# EAGLE design akabeacon_circle_MDBT40_type3 (EAGLE 9.6.2)
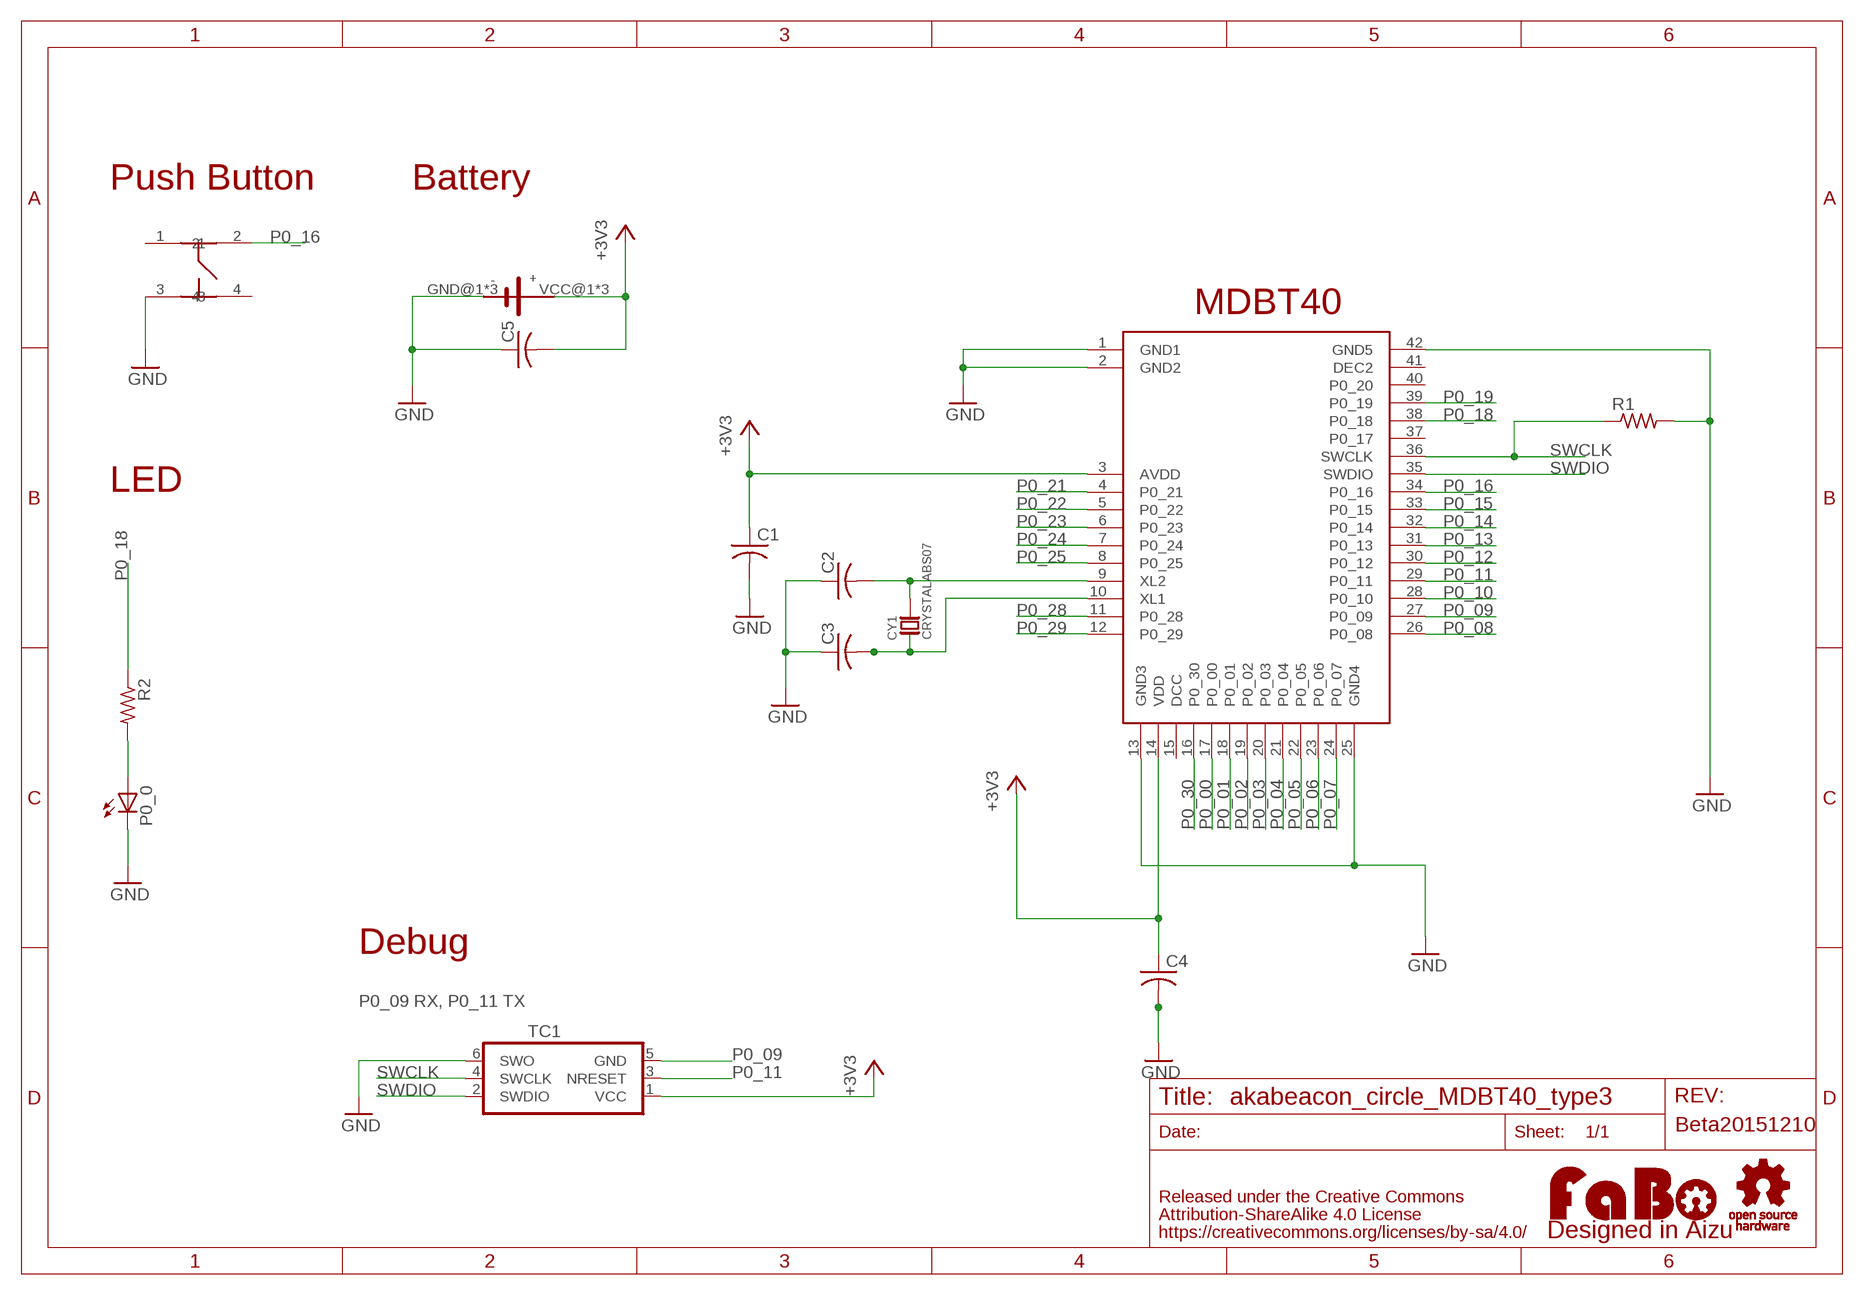
[diagram p0: schematic, sheet 1]

## Parts
C1  C-USC0603  [C0603]
C2  C-USC0603  [C0603]
C3  C-USC0603  [C0603]
C4  C-USC0603  [C0603]
C5  C-USC0603  [C0603]
CY1  CRYSTALABS07  [ABRACOM-ABS07-32.768KHZ]
P0_0  LEDCHIP-LED0603  [CHIP-LED0603]
R1  R-US_R0603  [R0603]
R2  R-US_R0603  [R0603]
TC1  TC2030-IDC-NL  [TC2030-IDC-NL]
U$1  RAYTAC-MDBT40  [RAYTAC-MDBT40]
U$2  LOGO_FABO-M  [LOGO_FABO_MS]
U$3  SQUARE-TYPE3  [SQUARE-TYPE3]
U$4  LOGO_OSHW-M_BOTTOM  [LOGO_OSHW_M_BOTTOM]
U$5  SWICTH-4P(KMR2)  [SWITCH-4P(KMR2)]

## Nets
+3V3: C1.1 C4.1 C5.2 TC1.1(VCC) U$1.3(AVDD) U$1.14(VDD) U$3.VCC@1(VCC) U$3.VCC@2(VCC) U$3.VCC@3(VCC)
GND: C1.2 C2.1 C3.1 C4.2 C5.1 P0_0.C R1.2 TC1.6(SWO) U$1.1(GND1) U$1.2(GND2) U$1.13(GND3) U$1.25(GND4) U$1.42(GND5) U$3.GND@1(GND) U$3.GND@2(GND) U$3.GND@3(GND) U$5.3
N$1: P0_0.A R2.2
N$7: C2.2 CY1.P$2 U$1.9(XL2)
N$8: C3.2 CY1.P$1 U$1.10(XL1)
P0_00: U$1.17(P0_00)
P0_01: U$1.18(P0_01)
P0_02: U$1.19(P0_02)
P0_03: U$1.20(P0_03)
P0_04: U$1.21(P0_04)
P0_05: U$1.22(P0_05)
P0_06: U$1.23(P0_06)
P0_07: U$1.24(P0_07)
P0_08: U$1.26(P0_08)
P0_09: TC1.5(GND) U$1.27(P0_09)
P0_10: U$1.28(P0_10)
P0_11: TC1.3(NRESET) U$1.29(P0_11)
P0_12: U$1.30(P0_12)
P0_13: U$1.31(P0_13)
P0_14: U$1.32(P0_14)
P0_15: U$1.33(P0_15)
P0_16: U$1.34(P0_16) U$5.2
P0_18: R2.1 U$1.38(P0_18)
P0_19: U$1.39(P0_19)
P0_21: U$1.4(P0_21)
P0_22: U$1.5(P0_22)
P0_23: U$1.6(P0_23)
P0_24: U$1.7(P0_24)
P0_25: U$1.8(P0_25)
P0_28: U$1.11(P0_28)
P0_29: U$1.12(P0_29)
P0_30: U$1.16(P0_30)
SWCLK: R1.1 TC1.4(SWCLK) U$1.36(SWCLK)
SWDIO: TC1.2(SWDIO) U$1.35(SWDIO)
Unconnected: U$1.15(DCC) U$1.37(P0_17) U$1.40(P0_20) U$1.41(DEC2) U$5.1 U$5.4

## Notes on the sheet
- Push Button | Battery
- MDBT40
- LED
- Debug
- P0_09 RX, P0_11 TX
- Beta20151210

## Library data of the parts
C1-C5 = adafruit:C-US: CAPACITOR, American symbol
CY1 = FaBo-Crystal:CRYSTAL
P0_0 = led:LED: LED OSRAM: - CHIPLED LG R971, LG N971, LY N971, LG Q971, LY Q971, LO R971, LY R971 LH N974, LH R974 LS Q976, LO Q976, LY Q976 LO Q996 - Hyper CHIPLED LW Q18S LB Q993, LB Q99A, LB R99A - SideLED LS A670, LO A670, LY A670, LG A670, LP A670 LB A673, LV A673, LT A673, LW A673 LH A674 LY A675 LS A676, LA A676, LO A676, LY A676, LW A676 LS A679, LY A679, LG A679 - Hyper Micro SIDELED® LS Y876, LA Y876, LO Y876, LY Y876 LT Y87S - SmartLED LW L88C, LW L88S LB L89C, LB L89S, LG L890 LS L89K, LO L89K, LY L89K LS L896, LA L896, LO L896, LY L896 - TOPLED LS T670, LO T670, LY T670, LG T670, LP T670 LSG T670, LSP T670, LSY T670, LOP T670, LYG T670 LG T671, LOG T671, LSG T671 LB T673, LV T673, LT T673, LW T673 LH T674 LS T676, LA T676, LO T676, LY T676, LB T676, LH T676, LSB T676, LW T676 LB T67C, LV T67C, LT T67C, LS T67K, LO T67K, LY T67K, LW E67C LS E67B, LA E67B, LO E67B, LY E67B, LB E67C, LV E67C, LT E67C LW T67C LS T679, LY T679, LG T679 LS T770, LO T770, LY T770, LG T770, LP T770 LB T773, LV T773, LT T773, LW T773 LH T774 LS E675, LA E675, LY E675, LS T675 LS T776, LA T776, LO T776, LY T776, LB T776 LHGB T686 LT T68C, LB T68C - Hyper Mini TOPLED® LB M676 - Mini TOPLED Santana® LG M470 LS M47K, LO M47K, LY M47K Source: http://www.osram.convergy.de LUXEON: - LUMILED® LXK2-PW12-R00, LXK2-PW12-S00, LXK2-PW14-U00, LXK2-PW14-V00 LXK2-PM12-R00, LXK2-PM12-S00, LXK2-PM14-U00 LXK2-PE12-Q00, LXK2-PE12-R00, LXK2-PE12-S00, LXK2-PE14-T00, LXK2-PE14-U00 LXK2-PB12-K00, LXK2-PB12-L00, LXK2-PB12-M00, LXK2-PB14-N00, LXK2-PB14-P00, LXK2-PB14-Q00 LXK2-PR12-L00, LXK2-PR12-M00, LXK2-PR14-Q00, LXK2-PR14-R00 LXK2-PD12-Q00, LXK2-PD12-R00, LXK2-PD12-S00 LXK2-PH12-R00, LXK2-PH12-S00 LXK2-PL12-P00, LXK2-PL12-Q00, LXK2-PL12-R00 Source: www.luxeon.com KINGBRIGHT: KA-3528ASYC Source: www.kingbright.com
R1 R2 = adafruit:R-US_: RESISTOR, American symbol
TC1 = TagConnect:TC2030-IDC: Tag-Connect In Circuit Programming & Debug Cable 6 Pin http://www.tag-connect.com
U$1 = FaBo-BT:RAYTAC-MDBT40
U$2 = FaBo-Logo:LOGO_FABO
U$3 = FaBo-Template:SQUARE-TYPE3
U$4 = FaBo-Logo:LOGO_OSHW
U$5 = gclue-test:SWICTH-4P(KMR2)

## Board
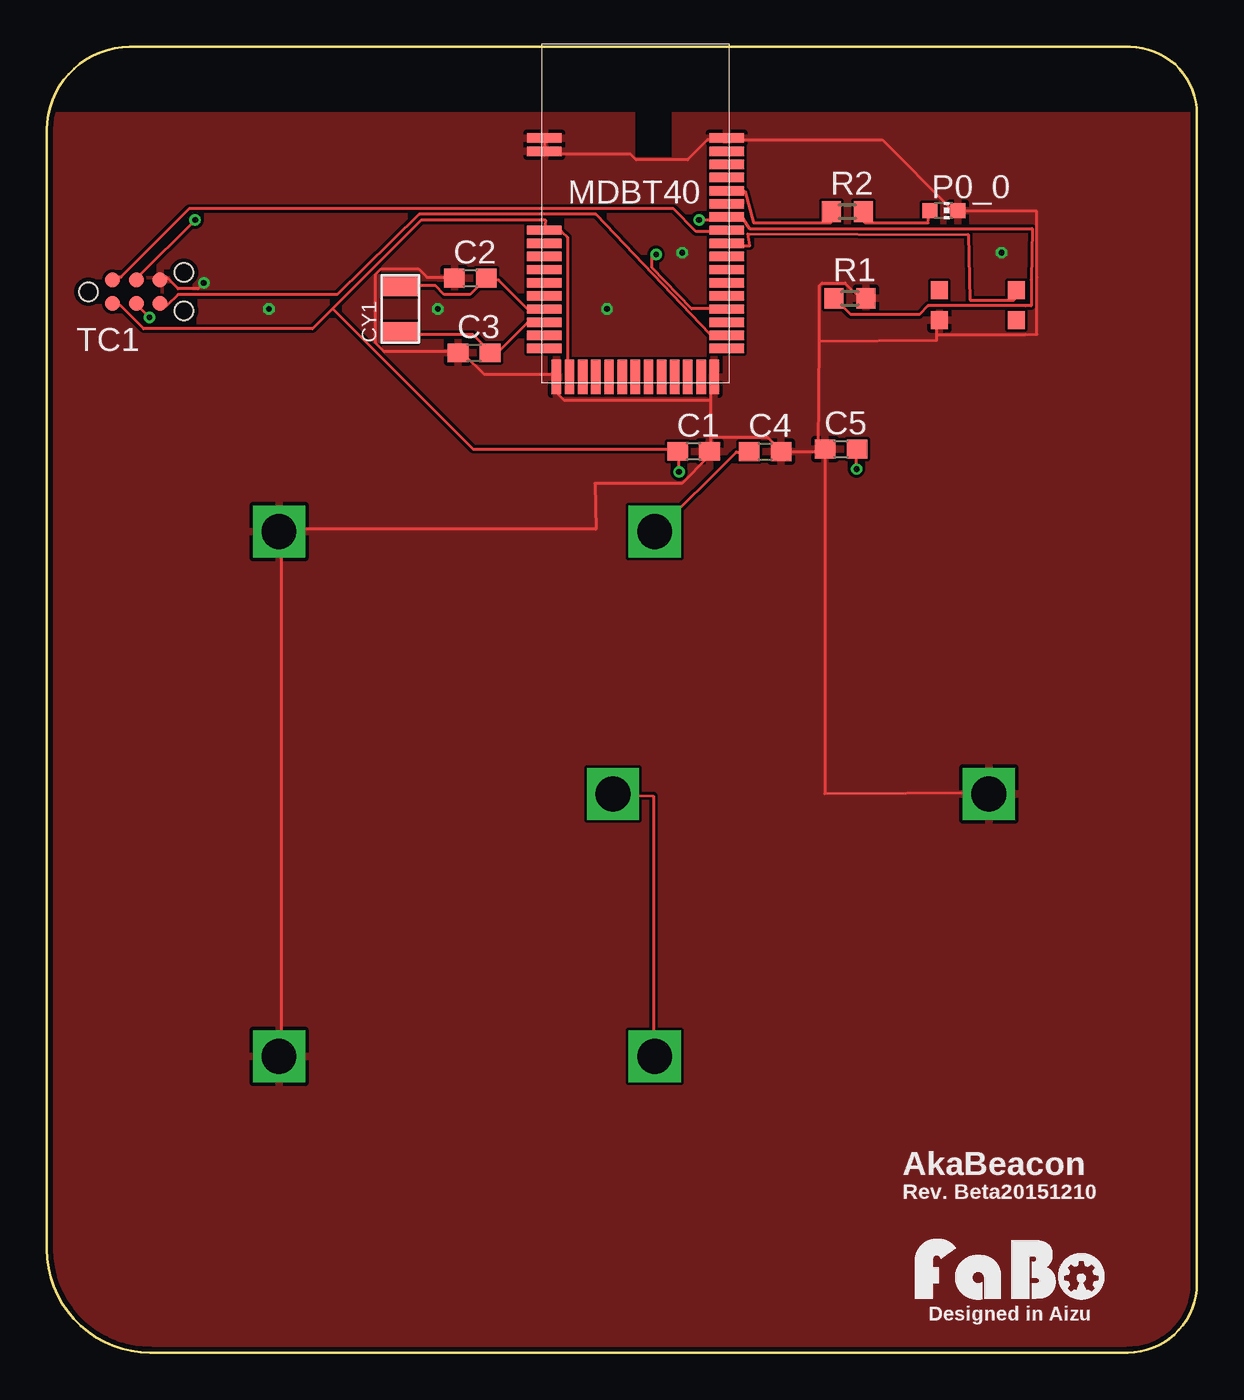
[diagram p1: board, top side]
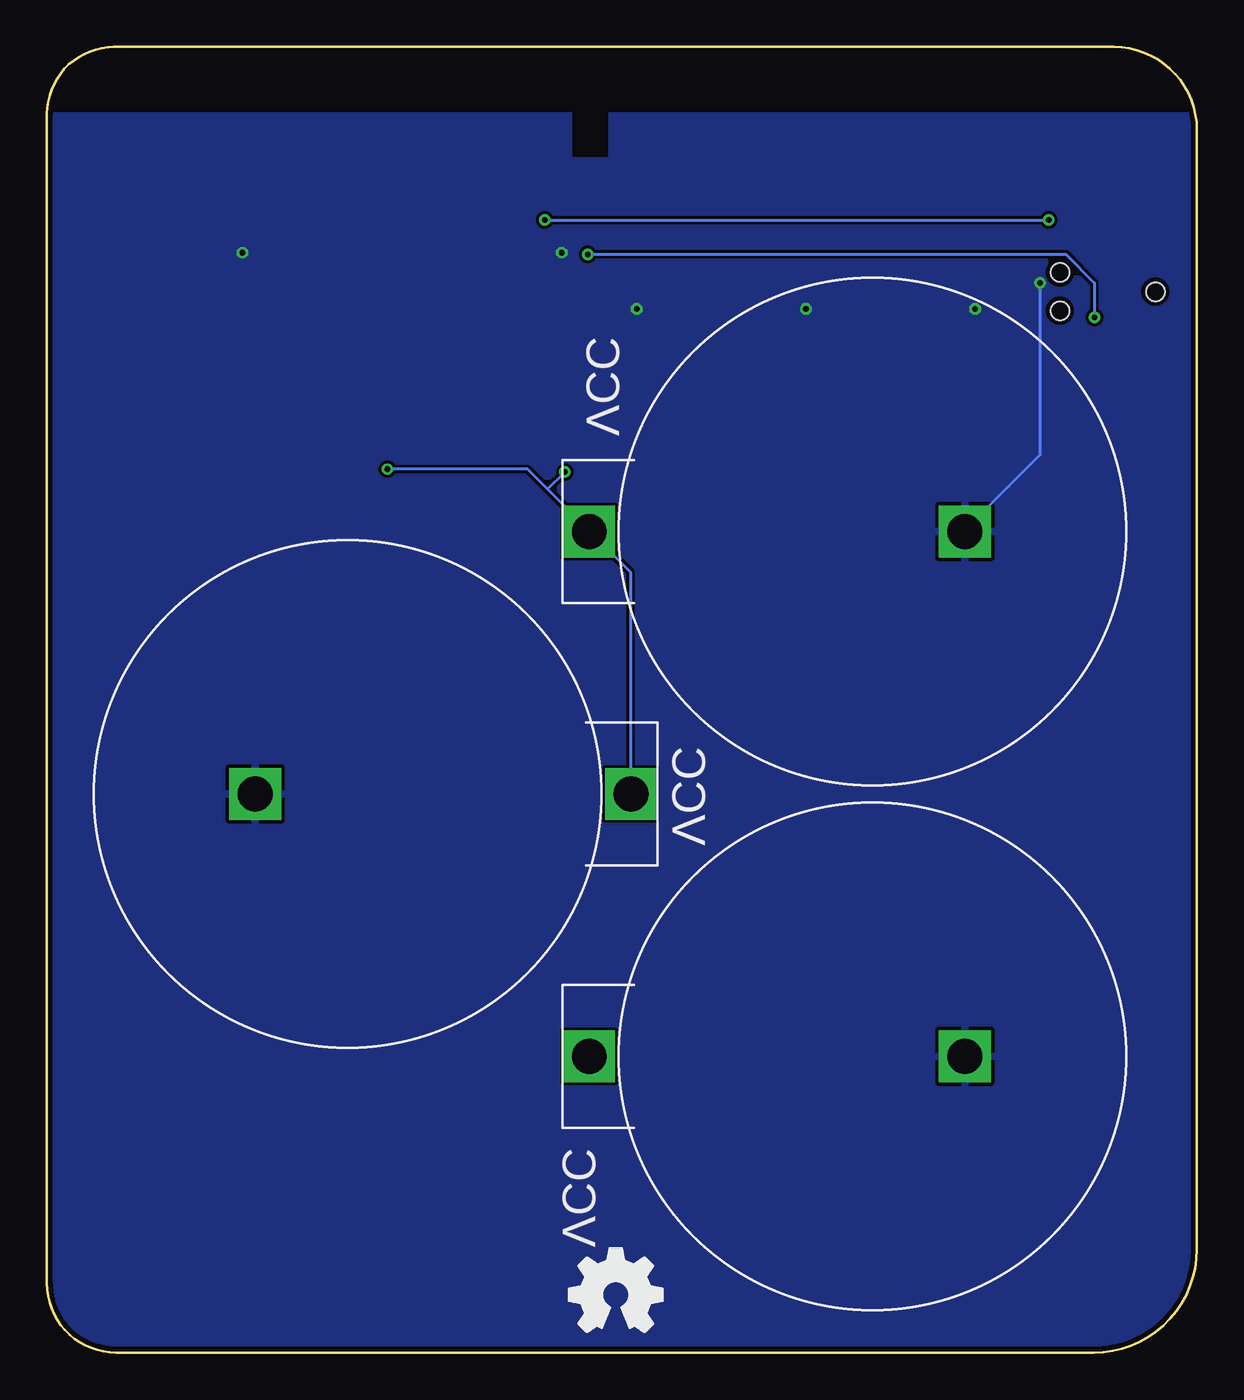
[diagram p2: board, bottom side, seen from below]

Size 61.21 x 69.49 mm. Coordinates in mm from the lower left corner, seen from the top.
Copper layers (1*16): Top 0.035mm / dielectric 1.6mm / Bottom 0.035mm
Design rules "PCBway": minimum track width 6mil, minimum drill 12mil, track to track 6mil, track to pad 6mil, pad to pad 6mil, via to via 6mil, smd to smd 6mil, copper to edge 10mil, drill to drill 10mil, minimum pad ring 10mil, minimum via ring 6mil, stop-mask expansion 2mil, vias tented up to drill 100mil, thermal gap 8mil
tRestrict: area -1.7,66 to 65.3,70
bRestrict: area -1.9,66 to 65.1,70

### Footprints (pad centres in the part's own frame; a part is rotated, then mirrored left to right if it is on the bottom)
C0603 = smd 1.1 x 1: 1 -0.85,0; 2 0.85,0
ABRACOM-ABS07-32.768KHZ = smd 1.1 x 1.9: P$1 -1.25,0; P$2 1.25,0
CHIP-LED0603 = smd 0.8 x 0.8: A 0,-0.75; C 0,0.75
R0603 = smd 1 x 1.1: 1 -0.85,0; 2 0.85,0
TC2030-IDC-NL = smd 0.787 x 0.787: 1 -1.27,-0.635; 2 -1.27,0.635; 3 0,-0.635; 4 0,0.635; 5 1.27,-0.635; 6 1.27,0.635 | hole 0.991: -2.54,0; 2.54,1.016; 2.54,-1.016
RAYTAC-MDBT40 = smd 1.85 x 0.5: 1 -4.86,4; 2 -4.86,3.3; 3 -4.86,-0.9; 4 -4.86,-1.6; 5 -4.86,-2.3; 6 -4.86,-3; 7 -4.86,-3.7; 8 -4.86,-4.4; 9 -4.86,-5.1; 10 -4.86,-5.8; 11 -4.86,-6.5; 12 -4.86,-7.2; 26 4.84,-7.2; 27 4.84,-6.5; 28 4.84,-5.8; 29 4.84,-5.1; 30 4.84,-4.4; 31 4.84,-3.7; 32 4.84,-3; 33 4.84,-2.3; 34 4.84,-1.6; 35 4.84,-0.9; 36 4.84,-0.2; 37 4.84,0.5; 38 4.84,1.2; 39 4.84,1.9; 40 4.84,2.6; 41 4.84,3.3; 42 4.84,4 | smd 0.5 x 1.85: 13 -4.22,-8.71; 14 -3.52,-8.71; 15 -2.82,-8.71; 16 -2.12,-8.71; 17 -1.42,-8.71; 18 -0.72,-8.71; 19 -0.02,-8.71; 20 0.68,-8.71; 21 1.38,-8.71; 22 2.08,-8.71; 23 2.78,-8.71; 24 3.48,-8.71; 25 4.18,-8.71
SQUARE-TYPE3 = drill 1.85 square: GND@1 -7.46,10.16; GND@2 30.32,-3.81; GND@3 -7.46,-17.78; VCC@1 12.54,10.16; VCC@2 10.32,-3.81; VCC@3 12.54,-17.78
SWITCH-4P(KMR2) = smd 0.9 x 0.95: 1 -1,0; 2 3.1,0; 3 -1,-1.6; 4 3.1,-1.6

### Placement (x,y rotation side)
C1  34.42,47.96 0 top
C2  22.53,57.18 0 top
C3  22.73,53.21 0 top
C4  38.23,47.95 0 top
C5  42.27,48.09 0 top
CY1  18.81,55.54 90 top
P0_0  47.73,60.78 270 top
R1  42.74,56.11 0 top
R2  42.6,60.72 0 top
TC1  4.75,56.46 0 top
U$1  31.34,60.64 0 top
U$2  51.25,2.44 0 top
U$3  19.81,33.54 0 top
U$4  30.92,3.08 0 top
U$5  48.49,56.55 0 top

### Tracks (layer width: path | path; a pad name or v marks a point on that pad's centre or on a via)
+3V3  (via drill 0.3)
  Top 0.152: 15.2,55.56 19.92,60.27 26.53,60.27 U$1.3 26.48,59.67 27.39,59.67 27.7,59.37 27.7,52.05 U$1.14 | 15.2,55.56 14.14,54.49 5.14,54.49 3.92,55.71 3.62,55.71 TC1.1 | 15.2,55.56 22.67,48.09 33.49,48.09 C1.1 33.64,47.94 v33.64,46.87 | C4.1 37.3,47.94 36.69,47.94 32.42,43.67 U$3.VCC@1 | v43.09,47.02 43.09,47.94 C5.2 | U$3.VCC@3 32.27,15.78 32.27,29.61 30.14,29.65 U$3.VCC@2
  Bottom 0.152: v43.09,47.02 35.62,47.02 34.56,45.95 | 34.56,45.95 32.42,43.82 U$3.VCC@1 32.27,43.67 30.14,41.54 30.14,29.8 U$3.VCC@2 | 34.56,45.95 v33.64,46.87
GND  (via drill 0.3)
  Top 0.152: v8.34,56.93 8.04,56.62 6.97,56.62 6.36,57.23 6.06,57.23 TC1.6 | U$3.GND@3 12.46,15.78 12.46,43.67 U$3.GND@1 12.46,43.82 29.22,43.82 29.16,46.26 33.8,46.26 35.17,47.63 35.17,47.94 C1.2 35.32,48.09 35.32,48.7 | U$1.1 26.48,64.55 U$1.2 26.48,63.79 31.05,63.79 31.36,63.48 34.1,63.48 35.17,64.55 36.08,64.55 U$1.42 36.23,64.55 44.46,64.55 48.12,60.89 48.43,60.89 P0_0.C 48.58,60.74 52.69,60.74 52.69,57.23 52.69,54.19 52.08,54.19 47.36,54.19 | C2.1 21.6,57.23 20.23,57.23 19.77,57.69 17.79,57.69 17.49,57.38 17.49,53.73 17.95,53.27 21.76,53.27 C3.1 21.91,53.12 22.21,53.12 23.28,52.05 27.09,52.05 U$1.13 27.24,51.9 27.24,50.98 27.55,50.68 35.32,50.68 | 35.32,50.68 35.32,51.75 35.47,51.9 U$1.25 | 35.32,50.68 35.32,48.7 | 47.36,54.19 47.36,53.88 41.12,53.84 | 47.36,54.19 47.36,54.95 U$5.3 | 41.12,53.84 41.07,48.09 C5.1 41.41,47.94 | 41.41,47.94 39.13,47.94 C4.2 38.98,48.09 38.37,48.7 35.32,48.7 | 41.12,53.84 41.11,55.25 41.11,56.78 41.26,56.93 42.48,56.93 43.24,56.17 43.55,56.17 R1.2 | 41.41,47.94 41.4,29.75 50.1,29.8 U$3.GND@2
  Bottom 0.152: v8.34,56.93 8.34,47.78 12.31,43.82 U$3.GND@1
  other vias: 29.81,55.54 20.81,55.54 11.81,55.54 33.81,58.54 50.81,58.54
  pour Bottom: -0.19,-0.46 61.81,-0.46 61.81,70.54 -0.19,70.54
  pour Top: -0.19,-0.46 61.81,-0.46 61.81,70.54 -0.19,70.54
N$1
  Top 0.152: P0_0.A 46.9,60.14 43.55,60.14 R2.2
N$7
  Top 0.152: U$1.9 26.33,55.56 25.57,55.56 24.04,57.08 23.43,57.08 C2.2 23.28,57.08 22.52,56.32 21.15,56.32 20.69,56.78 18.86,56.78 CY1.P$2
N$8
  Top 0.152: U$1.10 26.33,54.79 25.57,54.79 24.04,53.27 23.74,53.27 C3.2 23.58,53.27 22.67,54.19 18.86,54.19 CY1.P$1
P0_09
  Top 0.152: TC1.5 6.06,55.71 6.36,55.71 6.97,56.32 15.44,56.32 19.81,60.58 29.22,60.58 35.32,54.19 36.08,54.19 U$1.27
P0_11  (via drill 0.3)
  Top 0.152: v5.45,55.1 4.84,55.71 TC1.3 | v32.42,58.45 32.21,58.45 32.21,57.74 34.32,55.56 36.08,55.56 U$1.29
  Bottom 0.152: v5.45,55.1 5.45,56.93 6.97,58.45 v32.42,58.45
P0_16
  Top 0.152: U$5.2 51.47,56.02 49.13,56.02 49.04,59.51 37.31,59.54 37.41,58.91 36.23,58.91 U$1.34
P0_18
  Top 0.152: R2.1 41.72,60.14 37.61,60.14 37.15,61.8 36.23,61.8 U$1.38
SWCLK  (via drill 0.3)
  Top 0.152: v7.89,60.28 4.84,57.23 TC1.4 | v34.71,60.28 35.93,60.28 36.08,60.43 U$1.36 36.23,60.43 37,60.43 37.41,59.82 52.44,59.82 52.39,57.08 52.39,55.71 52.08,55.71 46.9,55.71 46.44,55.25 42.79,55.25 42.03,56.01 R1.1
  Bottom 0.152: v34.71,60.28 v7.89,60.28
SWDIO
  Top 0.152: TC1.2 3.62,57.23 3.92,57.23 7.58,60.89 33.34,60.89 34.56,59.67 36.08,59.67 U$1.35

### Text on the board
tPlace: AkaBeacon | Rev. Beta20151210 | Designed in Aizu